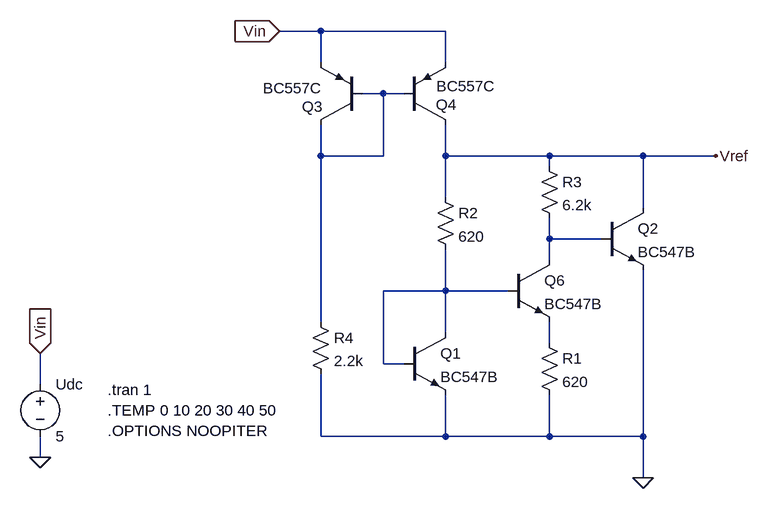
[diagram p0: schematic widlar-bandgap.asc]
widlar-bandgap.asc, the LTspice schematic file:
Version 4
SHEET 1 1928 680
WIRE 720 -240 656 -240
WIRE 912 -240 720 -240
WIRE 720 -192 720 -240
WIRE 912 -192 912 -240
WIRE 816 -144 784 -144
WIRE 848 -144 816 -144
WIRE 720 -48 720 -96
WIRE 816 -48 816 -144
WIRE 816 -48 720 -48
WIRE 912 -48 912 -96
WIRE 1072 -48 912 -48
WIRE 1216 -48 1072 -48
WIRE 1328 -48 1216 -48
WIRE 1072 -32 1072 -48
WIRE 912 16 912 -48
WIRE 1216 32 1216 -48
WIRE 1072 80 1072 48
WIRE 1152 80 1072 80
WIRE 1072 112 1072 80
WIRE 912 160 912 96
WIRE 912 160 816 160
WIRE 1008 160 912 160
WIRE 720 208 720 -48
WIRE 912 224 912 160
WIRE 1072 240 1072 208
WIRE 816 272 816 160
WIRE 848 272 816 272
WIRE 288 304 288 256
WIRE 720 384 720 288
WIRE 912 384 912 320
WIRE 912 384 720 384
WIRE 1072 384 1072 320
WIRE 1072 384 912 384
WIRE 1216 384 1216 128
WIRE 1216 384 1072 384
WIRE 288 416 288 384
WIRE 1216 448 1216 384
FLAG 1216 448 0
FLAG 288 416 0
FLAG 1328 -48 Vref
FLAG 656 -240 Vin
IOPIN 656 -240 In
FLAG 288 256 Vin
IOPIN 288 256 In
SYMBOL npn 1008 112 R0
SYMATTR InstName Q6
SYMATTR Value BC547B
SYMBOL npn 848 224 R0
SYMATTR InstName Q1
SYMATTR Value BC547B
SYMBOL npn 1152 32 R0
SYMATTR InstName Q2
SYMATTR Value BC547B
SYMBOL res 1056 224 R0
SYMATTR InstName R1
SYMATTR Value 620
SYMBOL res 896 0 R0
SYMATTR InstName R2
SYMATTR Value 620
SYMBOL res 1056 -48 R0
SYMATTR InstName R3
SYMATTR Value 6.2k
SYMBOL pnp 784 -96 R180
WINDOW 0 61 28 Left 2
WINDOW 3 62 56 Left 2
SYMATTR InstName Q3
SYMATTR Value BC557C
SYMBOL pnp 848 -96 M180
WINDOW 0 49 31 Left 2
WINDOW 3 50 59 Left 2
SYMATTR InstName Q4
SYMATTR Value BC557C
SYMBOL voltage 288 288 R0
WINDOW 123 0 0 Left 0
WINDOW 39 0 0 Left 0
SYMATTR InstName Udc
SYMATTR Value 5
SYMBOL res 704 192 R0
SYMATTR InstName R4
SYMATTR Value 2.2k
TEXT 392 312 Left 2 !.tran 1
TEXT 392 344 Left 2 !.TEMP 0 10 20 30 40 50\n.OPTIONS NOOPITER

The netlist it stands for:
* widlar-bandgap.asc
Q6 N002 N003 N004 0 BC547B
Q1 N003 N003 0 0 BC547B
Q2 Vref N002 0 0 BC547B
R1 N004 0 620
R2 Vref N003 620
R3 Vref N002 6.2k
Q3 N001 N001 Vin 0 BC557C
Q4 Vref N001 Vin 0 BC557C
V§Udc Vin 0 5
R4 N001 0 2.2k
.model NPN NPN
.model PNP PNP
.lib standard.bjt
.tran 1
.TEMP 0 10 20 30 40 50
.OPTIONS NOOPITER
.backanno
.end